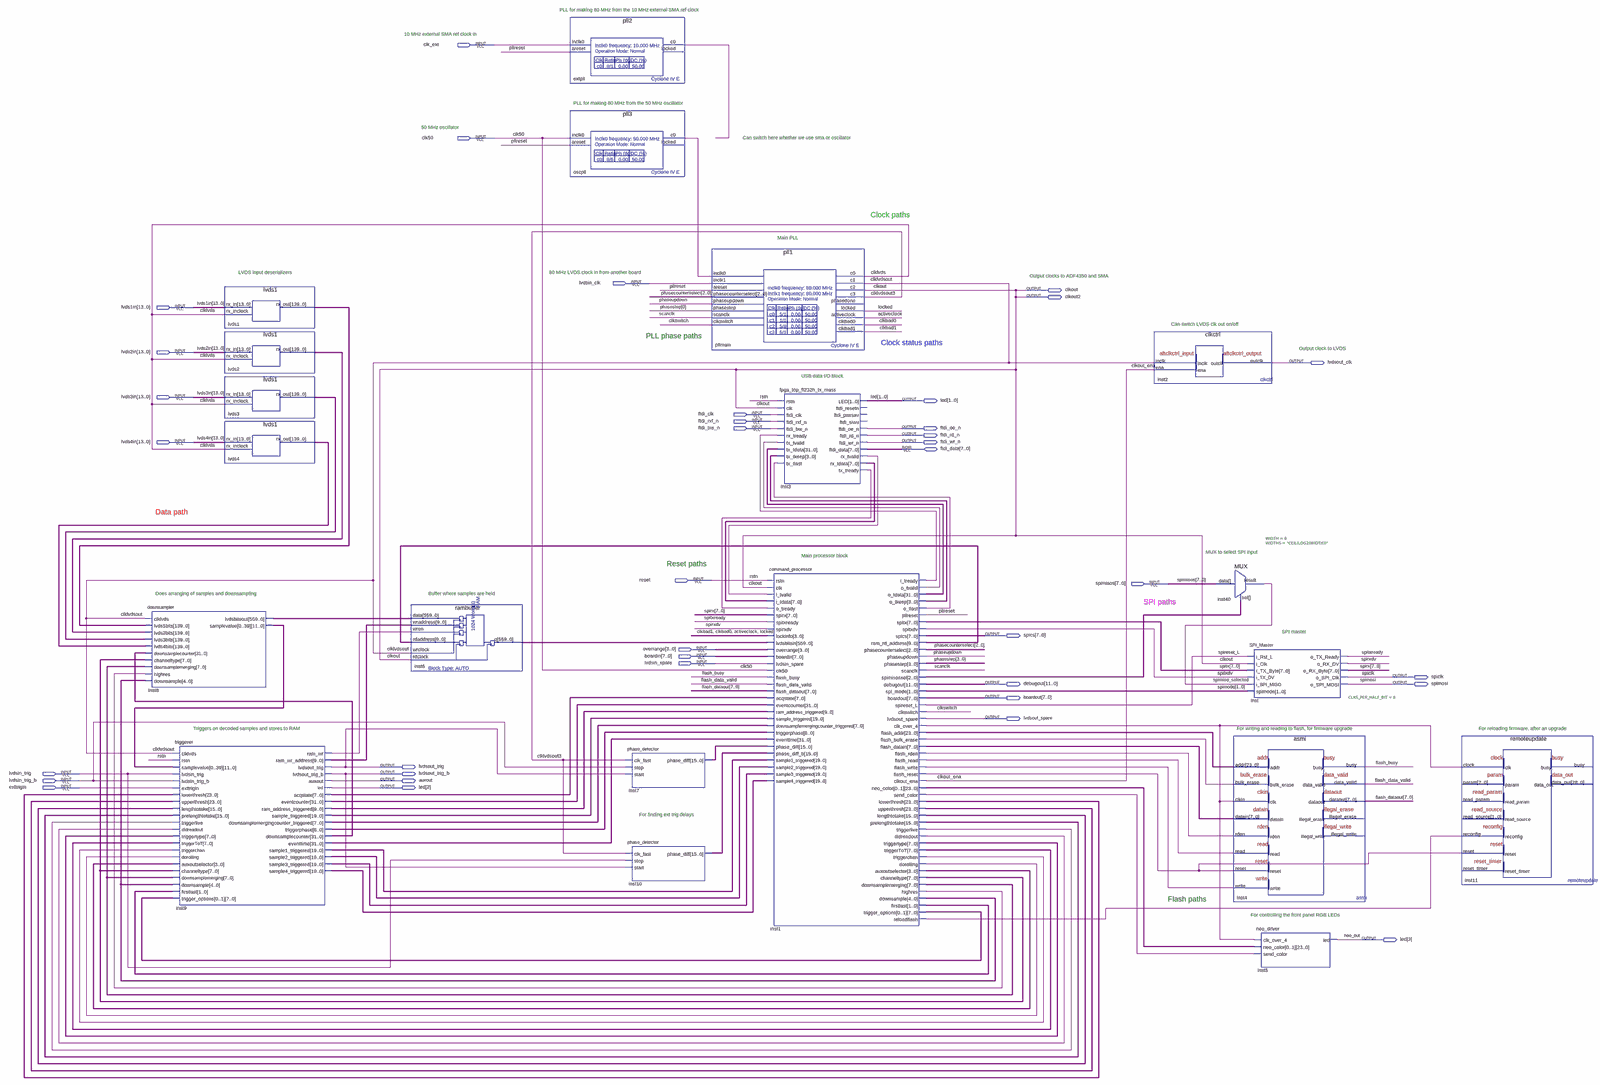
[diagram p0: schematic sheet, whole]
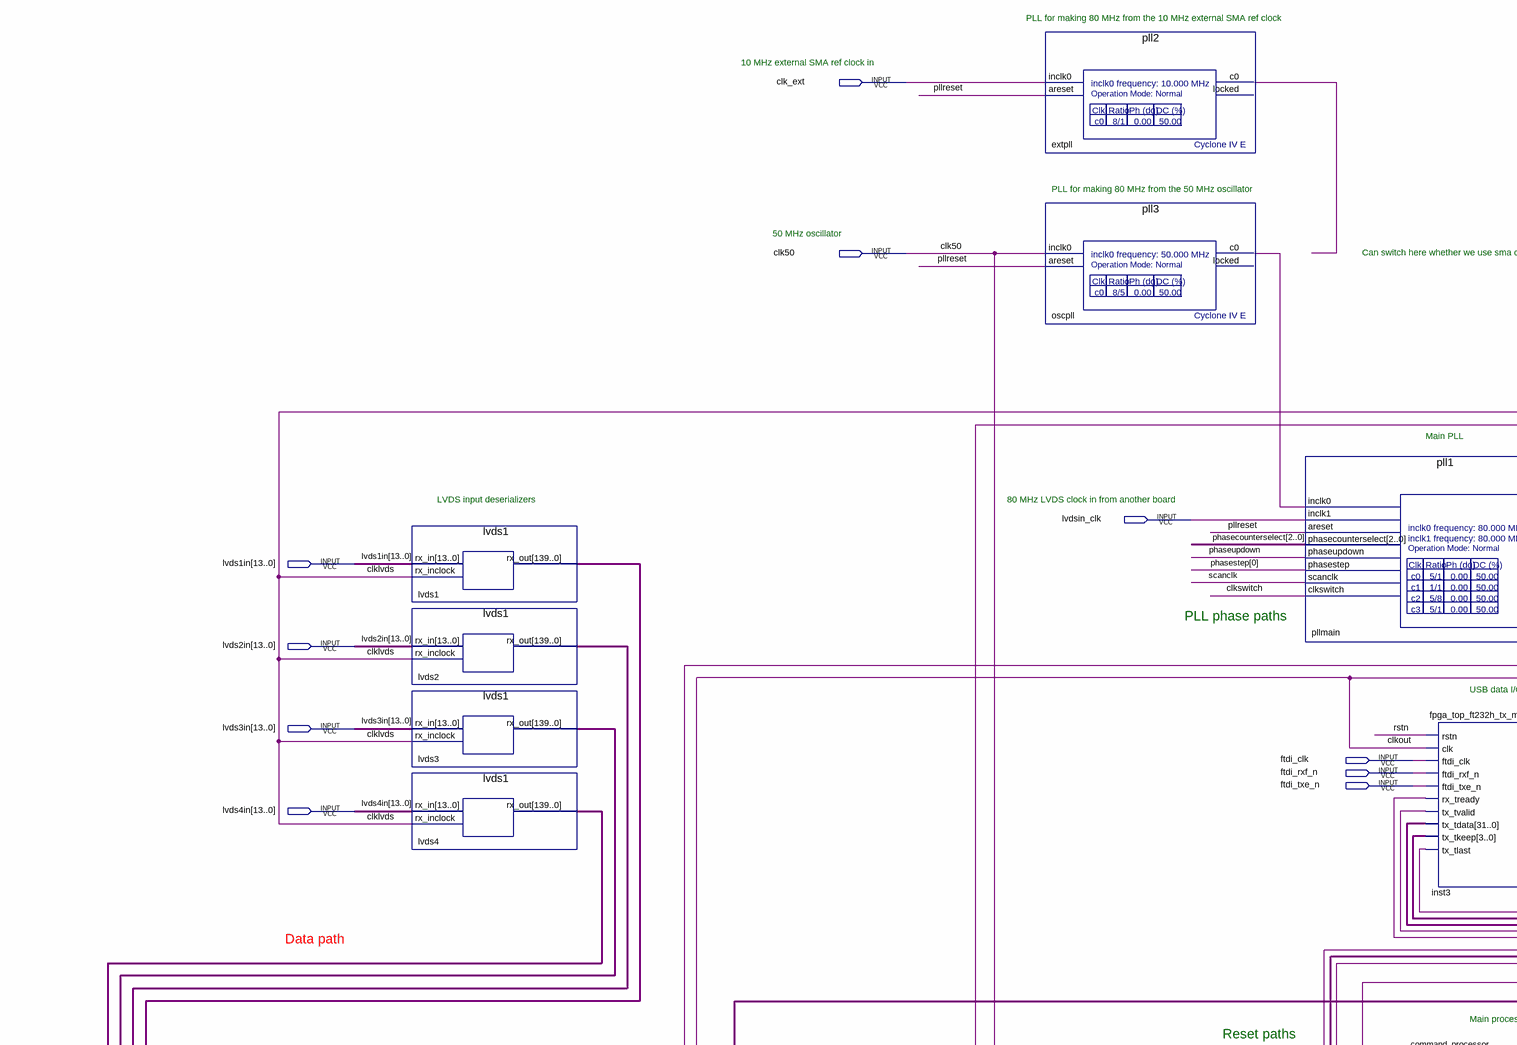
[diagram p1: schematic sheet, upper left part]
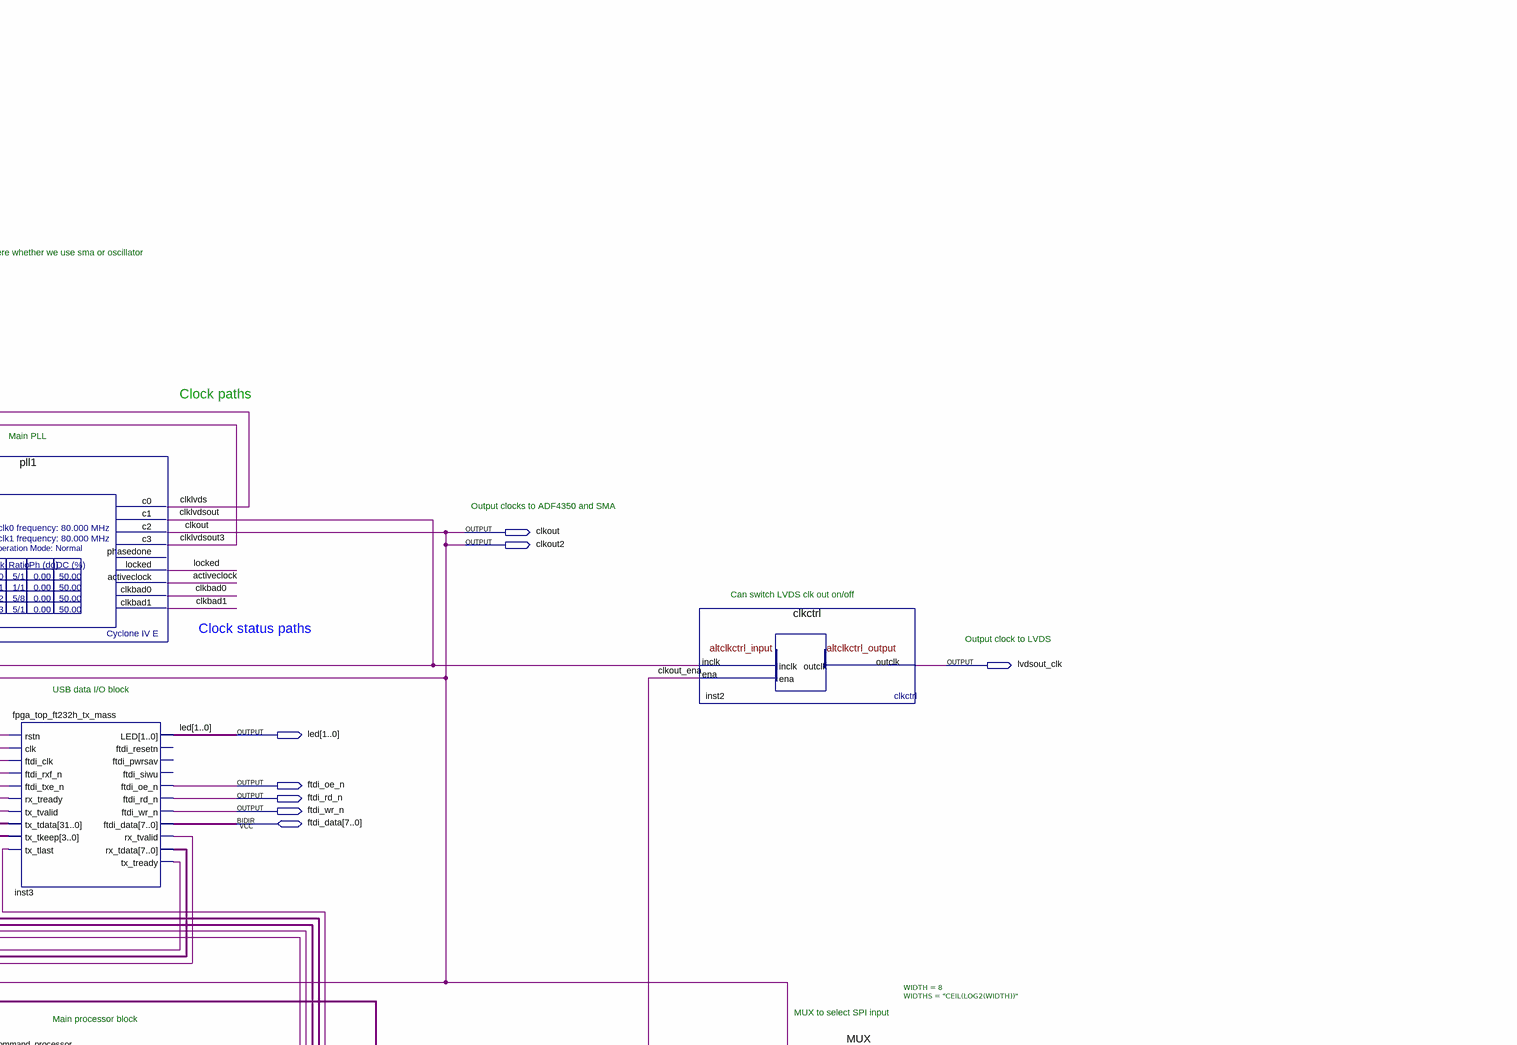
[diagram p2: schematic sheet, upper right part]
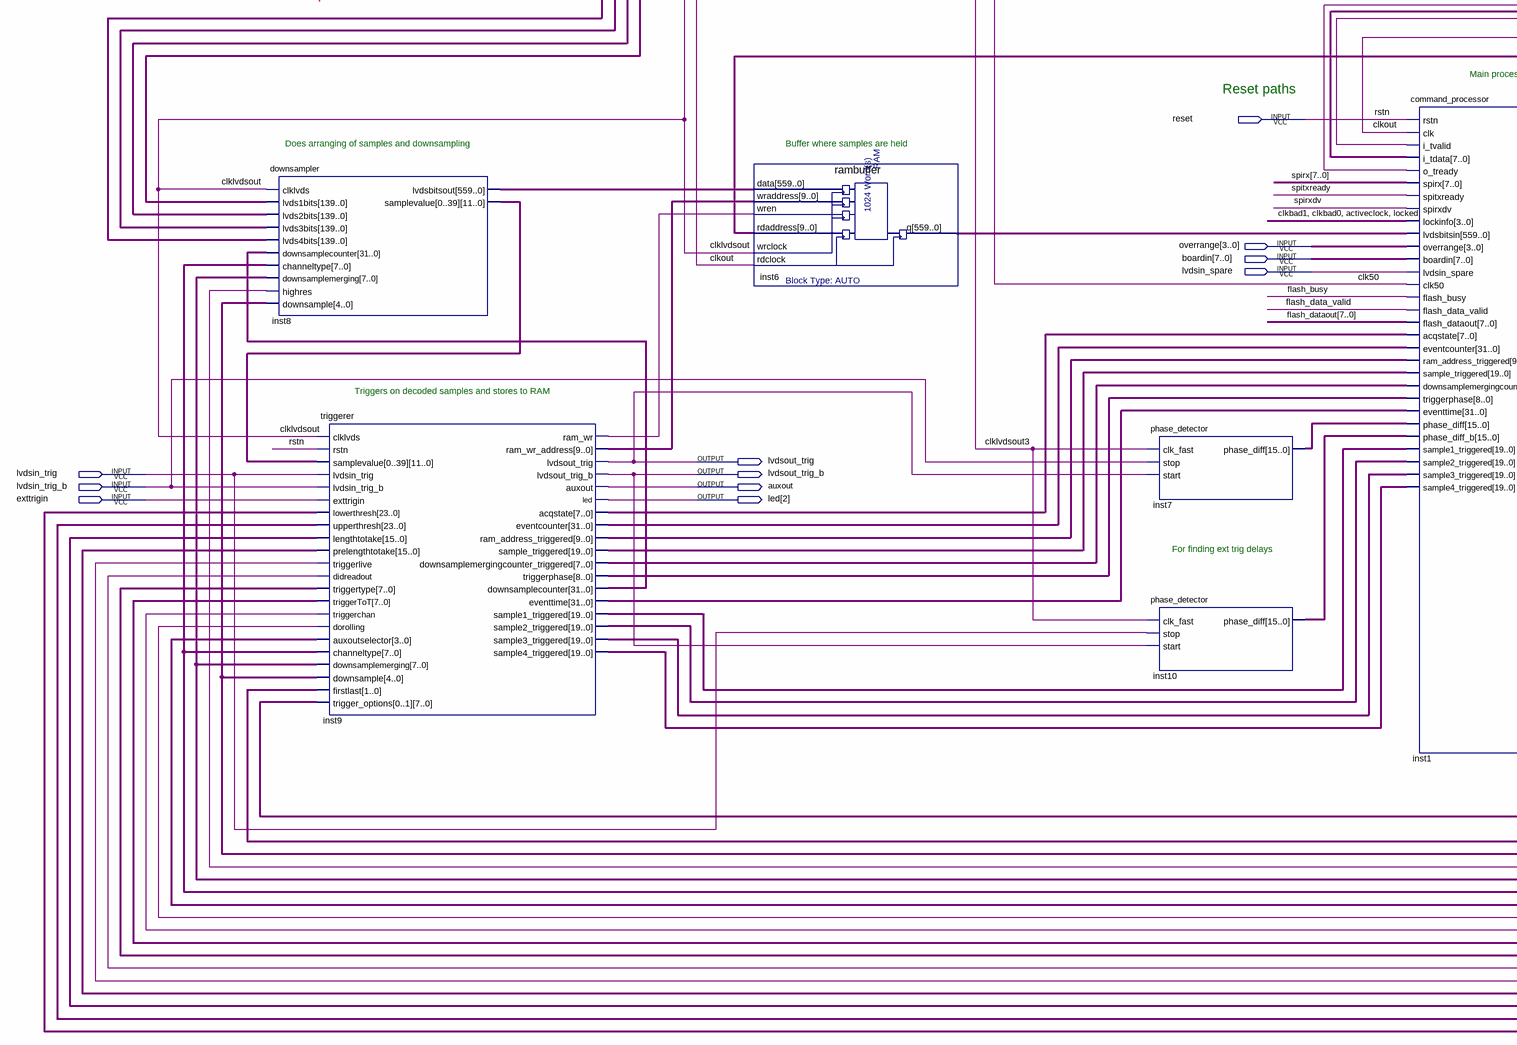
[diagram p3: schematic sheet, lower left part]
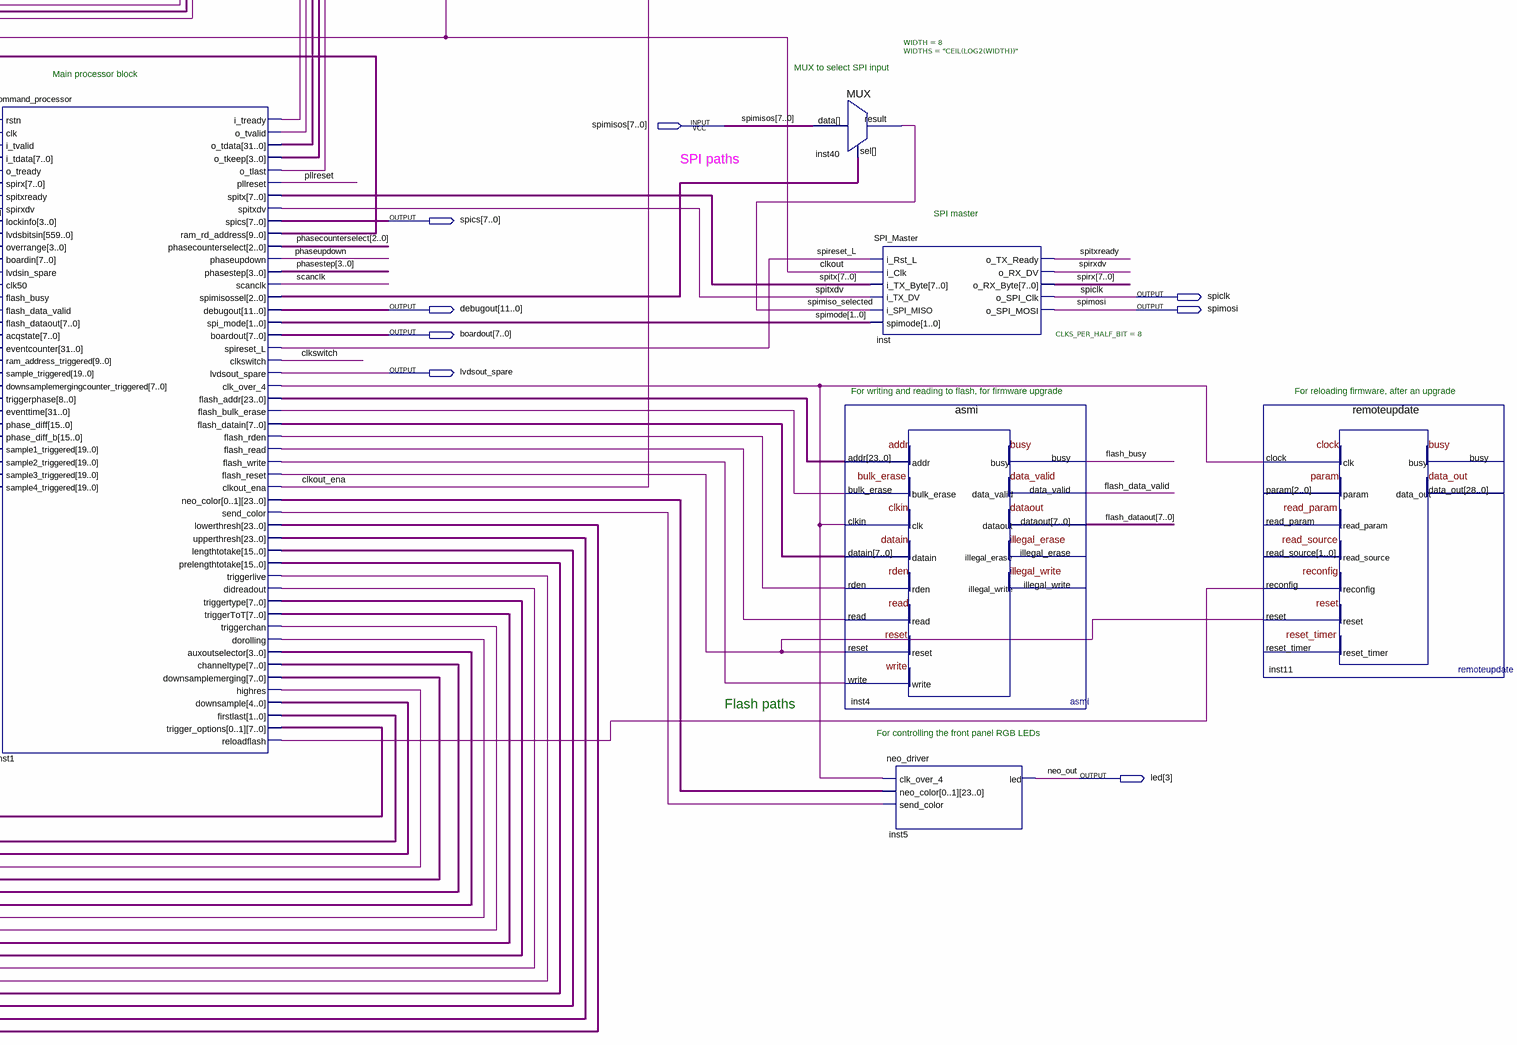
[diagram p4: schematic sheet, lower right part]
// Quartus schematic coincidence.bdf as structural Verilog: 20 symbols, 37 pins
module coincidence (
  input  clk_ext,
  input  clk50,
  input  lvdsin_clk,
  input  [13:0] lvds1in,
  input  [13:0] lvds2in,
  input  [13:0] lvds3in,
  input  ftdi_clk,
  input  ftdi_rxf_n,
  input  ftdi_txe_n,
  input  [13:0] lvds4in,
  input  reset,
  input  [7:0] spimisos,
  input  [3:0] overrange,
  input  [7:0] boardin,
  input  lvdsin_spare,
  input  lvdsin_trig,
  input  lvdsin_trig_b,
  input  exttrigin,
  inout  [7:0] ftdi_data,
  output clkout,
  output clkout2,
  output lvdsout_clk,
  output [3:0] led,
  output ftdi_oe_n,
  output ftdi_rd_n,
  output ftdi_wr_n,
  output [7:0] spics,
  output spiclk,
  output [11:0] debugout,
  output spimosi,
  output [7:0] boardout,
  output lvdsout_spare,
  output lvdsout_trig,
  output lvdsout_trig_b,
  output auxout
);

  wire activeclock, clkbad0, clkbad1, clklvds, clklvdsout, clklvdsout3, clkout_ena, clkswitch, extpll_c0,
       flash_busy, flash_data_valid, inst1_clk_over_4, inst1_didreadout, inst1_dorolling,
       inst1_flash_bulk_erase, inst1_flash_rden, inst1_flash_read, inst1_flash_reset, inst1_flash_write,
       inst1_highres, inst1_i_tready, inst1_o_tlast, inst1_o_tvalid, inst1_reloadflash, inst1_send_color,
       inst1_triggerchan, inst1_triggerlive, inst3_rx_tvalid, inst3_tx_tready, inst9_ram_wr, locked,
       oscpll_c0, phaseupdown, pllreset, scanclk, spimiso_selected, spireset_L, spirxdv, spitxdv, spitxready;
  wire [1:0] inst1_firstlast, spimode;
  wire [2:0] inst1_spimisossel, phasecounterselect;
  wire [3:0] inst1_auxoutselector, inst1_o_tkeep, phasestep;
  wire [4:0] inst1_downsample;
  wire [7:0] flash_dataout, inst1_channeltype, inst1_downsamplemerging, inst1_flash_datain, inst1_triggertot,
       inst1_triggertype, inst3_rx_tdata, inst9_acqstate, inst9_downsamplemergingcounter_triggered, spirx,
       spitx;
  wire [8:0] inst9_triggerphase;
  wire [9:0] inst1_ram_rd_address, inst9_ram_address_triggered, inst9_ram_wr_address;
  wire [15:0] inst1_lengthtotake, inst1_prelengthtotake, inst1_trigger_options, inst7_phase_diff,
       inst10_phase_diff;
  wire [19:0] inst9_sample1_triggered, inst9_sample2_triggered, inst9_sample3_triggered,
       inst9_sample4_triggered, inst9_sample_triggered;
  wire [23:0] inst1_flash_addr, inst1_lowerthresh, inst1_upperthresh;
  wire [31:0] inst1_o_tdata, inst9_downsamplecounter, inst9_eventcounter, inst9_eventtime;
  wire [47:0] inst1_neo_color;
  wire [139:0] lvds1_rx_out, lvds2_rx_out, lvds3_rx_out, lvds4_rx_out;
  wire [479:0] inst8_samplevalue;
  wire [559:0] inst6_q, inst8_lvdsbitsout;

  downsampler inst8 (
    .clklvds(clklvdsout), .lvds1bits(lvds1_rx_out), .lvds2bits(lvds2_rx_out), .lvds3bits(lvds3_rx_out),
    .lvds4bits(lvds4_rx_out), .downsamplecounter(inst9_downsamplecounter), .channeltype(inst1_channeltype),
    .downsamplemerging(inst1_downsamplemerging), .highres(inst1_highres), .downsample(inst1_downsample),
    .lvdsbitsout(inst8_lvdsbitsout), .samplevalue(inst8_samplevalue));
  triggerer inst9 (
    .clklvds(clklvdsout), .rstn(reset), .samplevalue(inst8_samplevalue), .lvdsin_trig(lvdsin_trig),
    .lvdsin_trig_b(lvdsin_trig_b), .exttrigin(exttrigin), .lowerthresh(inst1_lowerthresh),
    .upperthresh(inst1_upperthresh), .lengthtotake(inst1_lengthtotake),
    .prelengthtotake(inst1_prelengthtotake), .triggerlive(inst1_triggerlive), .didreadout(inst1_didreadout),
    .triggertype(inst1_triggertype), .triggerToT(inst1_triggertot), .triggerchan(inst1_triggerchan),
    .dorolling(inst1_dorolling), .auxoutselector(inst1_auxoutselector), .channeltype(inst1_channeltype),
    .downsamplemerging(inst1_downsamplemerging), .downsample(inst1_downsample), .firstlast(inst1_firstlast),
    .trigger_options(inst1_trigger_options), .ram_wr(inst9_ram_wr), .ram_wr_address(inst9_ram_wr_address),
    .lvdsout_trig(lvdsout_trig), .lvdsout_trig_b(lvdsout_trig_b), .auxout(auxout), .led(led[2]),
    .acqstate(inst9_acqstate), .eventcounter(inst9_eventcounter),
    .ram_address_triggered(inst9_ram_address_triggered), .sample_triggered(inst9_sample_triggered),
    .downsamplemergingcounter_triggered(inst9_downsamplemergingcounter_triggered),
    .triggerphase(inst9_triggerphase), .downsamplecounter(inst9_downsamplecounter),
    .eventtime(inst9_eventtime), .sample1_triggered(inst9_sample1_triggered),
    .sample2_triggered(inst9_sample2_triggered), .sample3_triggered(inst9_sample3_triggered),
    .sample4_triggered(inst9_sample4_triggered));
  lvds1 lvds1 (.rx_in(lvds1in), .rx_inclock(clklvds), .rx_out(lvds1_rx_out));
  lvds1 lvds2 (.rx_in(lvds2in), .rx_inclock(clklvds), .rx_out(lvds2_rx_out));
  lvds1 lvds3 (.rx_in(lvds3in), .rx_inclock(clklvds), .rx_out(lvds3_rx_out));
  lvds1 lvds4 (.rx_in(lvds4in), .rx_inclock(clklvds), .rx_out(lvds4_rx_out));
  rambuffer inst6 (
    .data(inst8_lvdsbitsout), .wraddress(inst9_ram_wr_address), .wren(inst9_ram_wr),
    .rdaddress(inst1_ram_rd_address), .wrclock(clklvdsout), .rdclock(clkout), .q(inst6_q));
  pll2 extpll (.inclk0(clk_ext), .areset(pllreset), .c0(extpll_c0));  // open: locked
  pll3 oscpll (.inclk0(clk50), .areset(pllreset), .c0(oscpll_c0));  // open: locked
  phase_detector inst7 (
    .clk_fast(clklvdsout3), .stop(lvdsin_trig_b), .start(lvdsout_trig), .phase_diff(inst7_phase_diff));
  phase_detector inst10 (
    .clk_fast(clklvdsout3), .stop(lvdsin_trig), .start(lvdsout_trig_b), .phase_diff(inst10_phase_diff));
  pll1 pllmain (
    .inclk0(oscpll_c0), .inclk1(lvdsin_clk), .areset(pllreset), .phasecounterselect(phasecounterselect),
    .phaseupdown(phaseupdown), .phasestep(phasestep[0]), .scanclk(scanclk), .clkswitch(clkswitch),
    .c0(clklvds), .c1(clklvdsout), .c2(clkout), .c3(clklvdsout3), .locked(locked), .activeclock(activeclock),
    .clkbad0(clkbad0), .clkbad1(clkbad1));  // open: phasedone
  fpga_top_ft232h_tx_mass inst3 (
    .rstn(reset), .clk(clkout), .ftdi_clk(ftdi_clk), .ftdi_rxf_n(ftdi_rxf_n), .ftdi_txe_n(ftdi_txe_n),
    .rx_tready(inst1_i_tready), .tx_tvalid(inst1_o_tvalid), .tx_tdata(inst1_o_tdata),
    .tx_tkeep(inst1_o_tkeep), .tx_tlast(inst1_o_tlast), .LED(led[1:0]), .ftdi_oe_n(ftdi_oe_n),
    .ftdi_rd_n(ftdi_rd_n), .ftdi_wr_n(ftdi_wr_n), .rx_tvalid(inst3_rx_tvalid), .rx_tdata(inst3_rx_tdata),
    .tx_tready(inst3_tx_tready), .ftdi_data(ftdi_data));  // open: ftdi_resetn, ftdi_pwrsav, ftdi_siwu
  command_processor inst1 (
    .rstn(reset), .clk(clkout), .i_tvalid(inst3_rx_tvalid), .i_tdata(inst3_rx_tdata),
    .o_tready(inst3_tx_tready), .spirx(spirx), .spitxready(spitxready), .spirxdv(spirxdv),
    .lockinfo({clkbad1, clkbad0, activeclock, locked}), .lvdsbitsin(inst6_q), .overrange(overrange),
    .boardin(boardin), .lvdsin_spare(lvdsin_spare), .clk50(clk50), .flash_busy(flash_busy),
    .flash_data_valid(flash_data_valid), .flash_dataout(flash_dataout), .acqstate(inst9_acqstate),
    .eventcounter(inst9_eventcounter), .ram_address_triggered(inst9_ram_address_triggered),
    .sample_triggered(inst9_sample_triggered),
    .downsamplemergingcounter_triggered(inst9_downsamplemergingcounter_triggered),
    .triggerphase(inst9_triggerphase), .eventtime(inst9_eventtime), .phase_diff(inst7_phase_diff),
    .phase_diff_b(inst10_phase_diff), .sample1_triggered(inst9_sample1_triggered),
    .sample2_triggered(inst9_sample2_triggered), .sample3_triggered(inst9_sample3_triggered),
    .sample4_triggered(inst9_sample4_triggered), .i_tready(inst1_i_tready), .o_tvalid(inst1_o_tvalid),
    .o_tdata(inst1_o_tdata), .o_tkeep(inst1_o_tkeep), .o_tlast(inst1_o_tlast), .pllreset(pllreset),
    .spitx(spitx), .spitxdv(spitxdv), .spics(spics), .ram_rd_address(inst1_ram_rd_address),
    .phasecounterselect(phasecounterselect), .phaseupdown(phaseupdown), .phasestep(phasestep),
    .scanclk(scanclk), .spimisossel(inst1_spimisossel), .debugout(debugout), .spi_mode(spimode),
    .boardout(boardout), .spireset_L(spireset_L), .clkswitch(clkswitch), .lvdsout_spare(lvdsout_spare),
    .clk_over_4(inst1_clk_over_4), .flash_addr(inst1_flash_addr), .flash_bulk_erase(inst1_flash_bulk_erase),
    .flash_datain(inst1_flash_datain), .flash_rden(inst1_flash_rden), .flash_read(inst1_flash_read),
    .flash_write(inst1_flash_write), .flash_reset(inst1_flash_reset), .clkout_ena(clkout_ena),
    .neo_color(inst1_neo_color), .send_color(inst1_send_color), .lowerthresh(inst1_lowerthresh),
    .upperthresh(inst1_upperthresh), .lengthtotake(inst1_lengthtotake),
    .prelengthtotake(inst1_prelengthtotake), .triggerlive(inst1_triggerlive), .didreadout(inst1_didreadout),
    .triggertype(inst1_triggertype), .triggerToT(inst1_triggertot), .triggerchan(inst1_triggerchan),
    .dorolling(inst1_dorolling), .auxoutselector(inst1_auxoutselector), .channeltype(inst1_channeltype),
    .downsamplemerging(inst1_downsamplemerging), .highres(inst1_highres), .downsample(inst1_downsample),
    .firstlast(inst1_firstlast), .trigger_options(inst1_trigger_options), .reloadflash(inst1_reloadflash));
  clkctrl inst2 (.inclk(clklvdsout), .ena(clkout_ena), .outclk(lvdsout_clk));
  MUX #(.WIDTH(8), .WIDTHS("CEIL(LOG2(WIDTH))")) inst40 (
    .data(spimisos), .sel(inst1_spimisossel), .result(spimiso_selected));
  SPI_Master #(.CLKS_PER_HALF_BIT(8)) inst (
    .i_Rst_L(spireset_L), .i_Clk(clkout), .i_TX_Byte(spitx), .i_TX_DV(spitxdv),
    .i_SPI_MISO(spimiso_selected), .spimode(spimode), .o_TX_Ready(spitxready), .o_RX_DV(spirxdv),
    .o_RX_Byte(spirx), .o_SPI_Clk(spiclk), .o_SPI_MOSI(spimosi));
  asmi inst4 (
    .addr(inst1_flash_addr), .bulk_erase(inst1_flash_bulk_erase), .clkin(inst1_clk_over_4),
    .datain(inst1_flash_datain), .rden(inst1_flash_rden), .read(inst1_flash_read), .reset(inst1_flash_reset),
    .write(inst1_flash_write), .busy(flash_busy), .data_valid(flash_data_valid), .dataout(flash_dataout));  // open: illegal_erase, illegal_write
  neo_driver inst5 (
    .clk_over_4(inst1_clk_over_4), .neo_color(inst1_neo_color), .send_color(inst1_send_color), .led(led[3]));
  remoteupdate inst11 (
    .clock(inst1_clk_over_4), .reconfig(inst1_reloadflash), .reset(inst1_flash_reset));  // open: param, read_param, read_source, reset_timer, busy, data_out

  assign clkout2 = clkout;

  // Other names for the same wires on the sheet: neo_out = led[3]; rstn = reset

  // Notes on the sheet:
  //   PLL for making 80 MHz from the 10 MHz external SMA ref clock
  //   10 MHz external SMA ref clock in
  //   PLL for making 80 MHz from the 50 MHz oscillator
  //   50 MHz oscillator
  //   Can switch here whether we use sma or oscillator
  //   Clock paths
  //   Main PLL
  //   LVDS input deserializers
  //   80 MHz LVDS clock in from another board
  //   Output clocks to ADF4350 and SMA
  //   Can switch LVDS clk out on/off
  //   PLL phase paths
  //   Clock status paths
  //   Output clock to LVDS
  //   USB data I/O block
  //   Data path
  //   MUX to select SPI input
  //   Main processor block
  //   Reset paths
  //   Does arranging of samples and downsampling
  //   Buffer where samples are held
  //   SPI paths
  //   SPI master
  //   Triggers on decoded samples and stores to RAM
  //   For writing and reading to flash, for firmware upgrade
  //   For reloading firmware, after an upgrade
  //   For finding ext trig delays
  //   Flash paths
  //   For controlling the front panel RGB LEDs
endmodule
